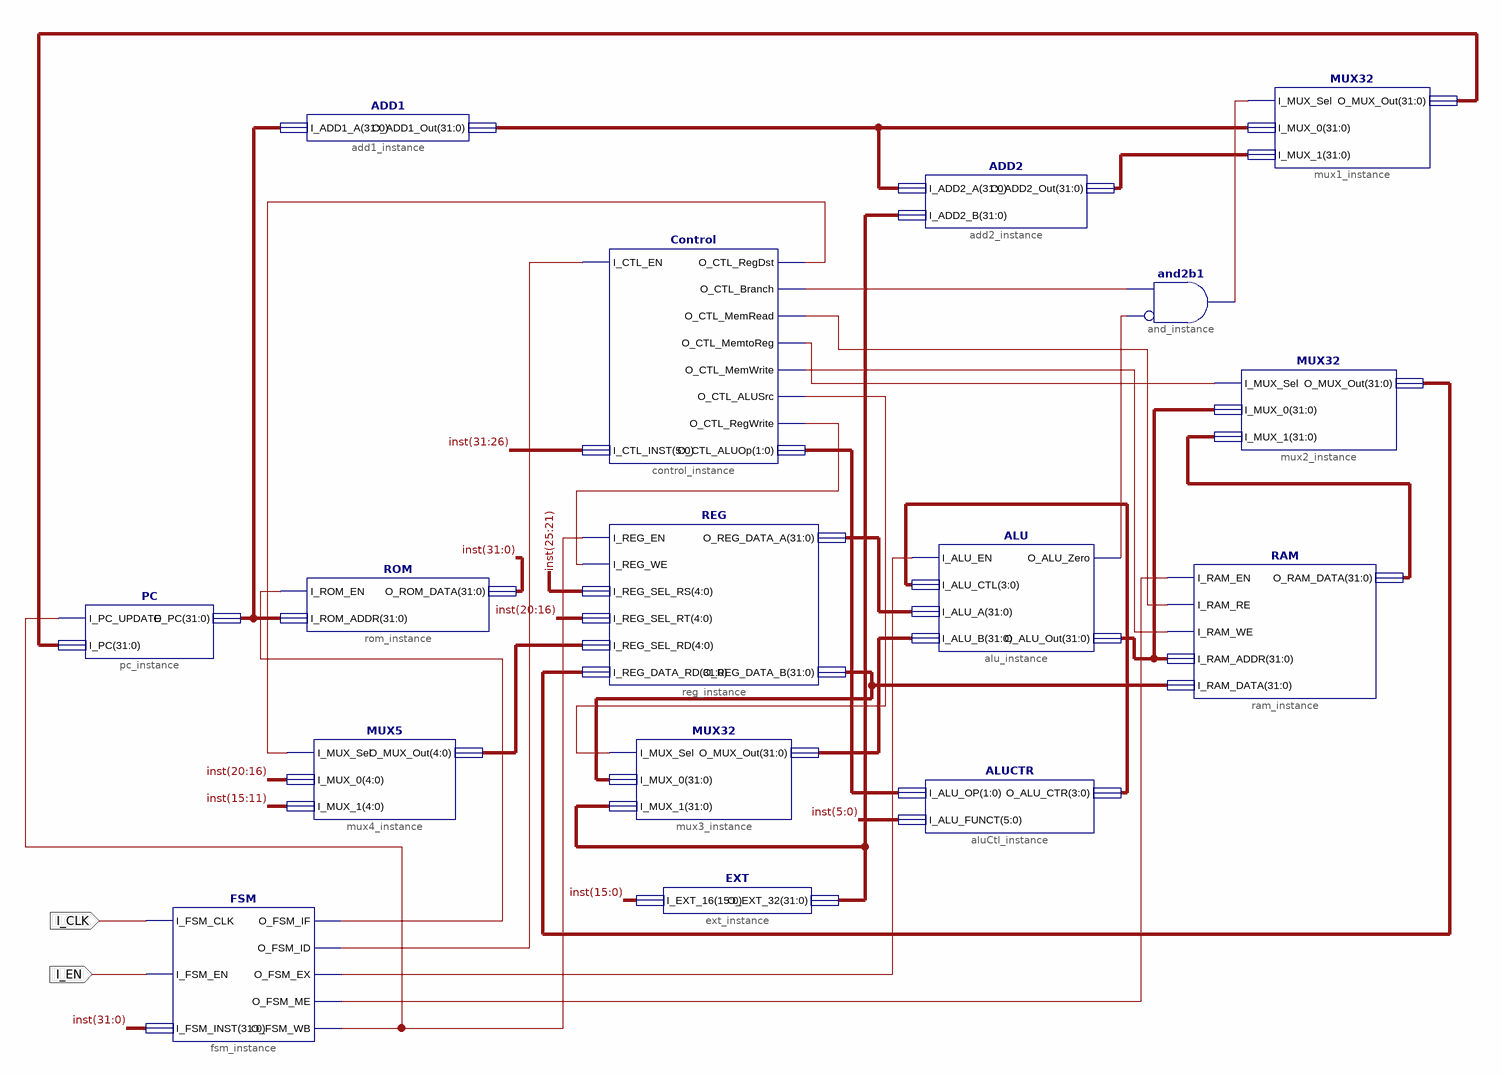
[diagram p0: schematic sheet 1]
// Xilinx ISE schematic Processor.sch (artix7) as structural Verilog: 16 symbols, 2 ports
module Processor (
  input  I_CLK,
  input  I_EN
);

  wire XLXN_5, XLXN_6, XLXN_7, XLXN_12, XLXN_14, XLXN_28, XLXN_30, XLXN_31, XLXN_60, XLXN_63, XLXN_64,
       XLXN_65, XLXN_86, XLXN_87;
  wire [1:0] XLXN_100;
  wire [3:0] XLXN_78;
  wire [4:0] XLXN_58;
  wire [31:0] inst, XLXN_13, XLXN_18, XLXN_22, XLXN_26, XLXN_67, XLXN_68, XLXN_69, XLXN_77, XLXN_79, XLXN_80,
       XLXN_98;

  FSM fsm_instance (
    .I_FSM_CLK(I_CLK), .I_FSM_EN(I_EN), .I_FSM_INST(inst), .O_FSM_IF(XLXN_14), .O_FSM_ID(XLXN_5),
    .O_FSM_EX(XLXN_6), .O_FSM_ME(XLXN_7), .O_FSM_WB(XLXN_12));
  PC pc_instance (.I_PC_UPDATE(XLXN_12), .I_PC(XLXN_18), .O_PC(XLXN_13));
  ROM rom_instance (.I_ROM_EN(XLXN_14), .I_ROM_ADDR(XLXN_13), .O_ROM_DATA(inst));
  Control control_instance (
    .I_CTL_EN(XLXN_5), .I_CTL_INST(inst[31:26]), .O_CTL_RegDst(XLXN_60), .O_CTL_Branch(XLXN_30),
    .O_CTL_MemRead(XLXN_86), .O_CTL_MemtoReg(XLXN_87), .O_CTL_MemWrite(XLXN_63), .O_CTL_ALUSrc(XLXN_64),
    .O_CTL_RegWrite(XLXN_65), .O_CTL_ALUOp(XLXN_100));
  ADD1 add1_instance (.I_ADD1_A(XLXN_13), .O_ADD1_Out(XLXN_22));
  ADD2 add2_instance (.I_ADD2_A(XLXN_22), .I_ADD2_B(XLXN_98), .O_ADD2_Out(XLXN_26));
  MUX5 mux4_instance (.I_MUX_Sel(XLXN_60), .I_MUX_0(inst[20:16]), .I_MUX_1(inst[15:11]), .O_MUX_Out(XLXN_58));
  MUX32 mux1_instance (.I_MUX_Sel(XLXN_28), .I_MUX_0(XLXN_22), .I_MUX_1(XLXN_26), .O_MUX_Out(XLXN_18));
  and and_instance (XLXN_28, ~XLXN_31, XLXN_30);  // and2b1
  ALU alu_instance (
    .I_ALU_EN(XLXN_6), .I_ALU_CTL(XLXN_78), .I_ALU_A(XLXN_68), .I_ALU_B(XLXN_77), .O_ALU_Zero(XLXN_31),
    .O_ALU_Out(XLXN_79));
  RAM ram_instance (
    .I_RAM_EN(XLXN_7), .I_RAM_RE(XLXN_86), .I_RAM_WE(XLXN_63), .I_RAM_ADDR(XLXN_79), .I_RAM_DATA(XLXN_69),
    .O_RAM_DATA(XLXN_80));
  ALUCTR aluCtl_instance (.I_ALU_OP(XLXN_100), .I_ALU_FUNCT(inst[5:0]), .O_ALU_CTR(XLXN_78));
  MUX32 mux2_instance (.I_MUX_Sel(XLXN_87), .I_MUX_0(XLXN_79), .I_MUX_1(XLXN_80), .O_MUX_Out(XLXN_67));
  MUX32 mux3_instance (.I_MUX_Sel(XLXN_64), .I_MUX_0(XLXN_69), .I_MUX_1(XLXN_98), .O_MUX_Out(XLXN_77));
  EXT ext_instance (.I_EXT_16(inst[15:0]), .O_EXT_32(XLXN_98));
  REG reg_instance (
    .I_REG_EN(XLXN_12), .I_REG_WE(XLXN_65), .I_REG_SEL_RS(inst[25:21]), .I_REG_SEL_RT(inst[20:16]),
    .I_REG_SEL_RD(XLXN_58), .I_REG_DATA_RD(XLXN_67), .O_REG_DATA_A(XLXN_68), .O_REG_DATA_B(XLXN_69));
endmodule
